# Altium project ESC_1S.PrjPcb
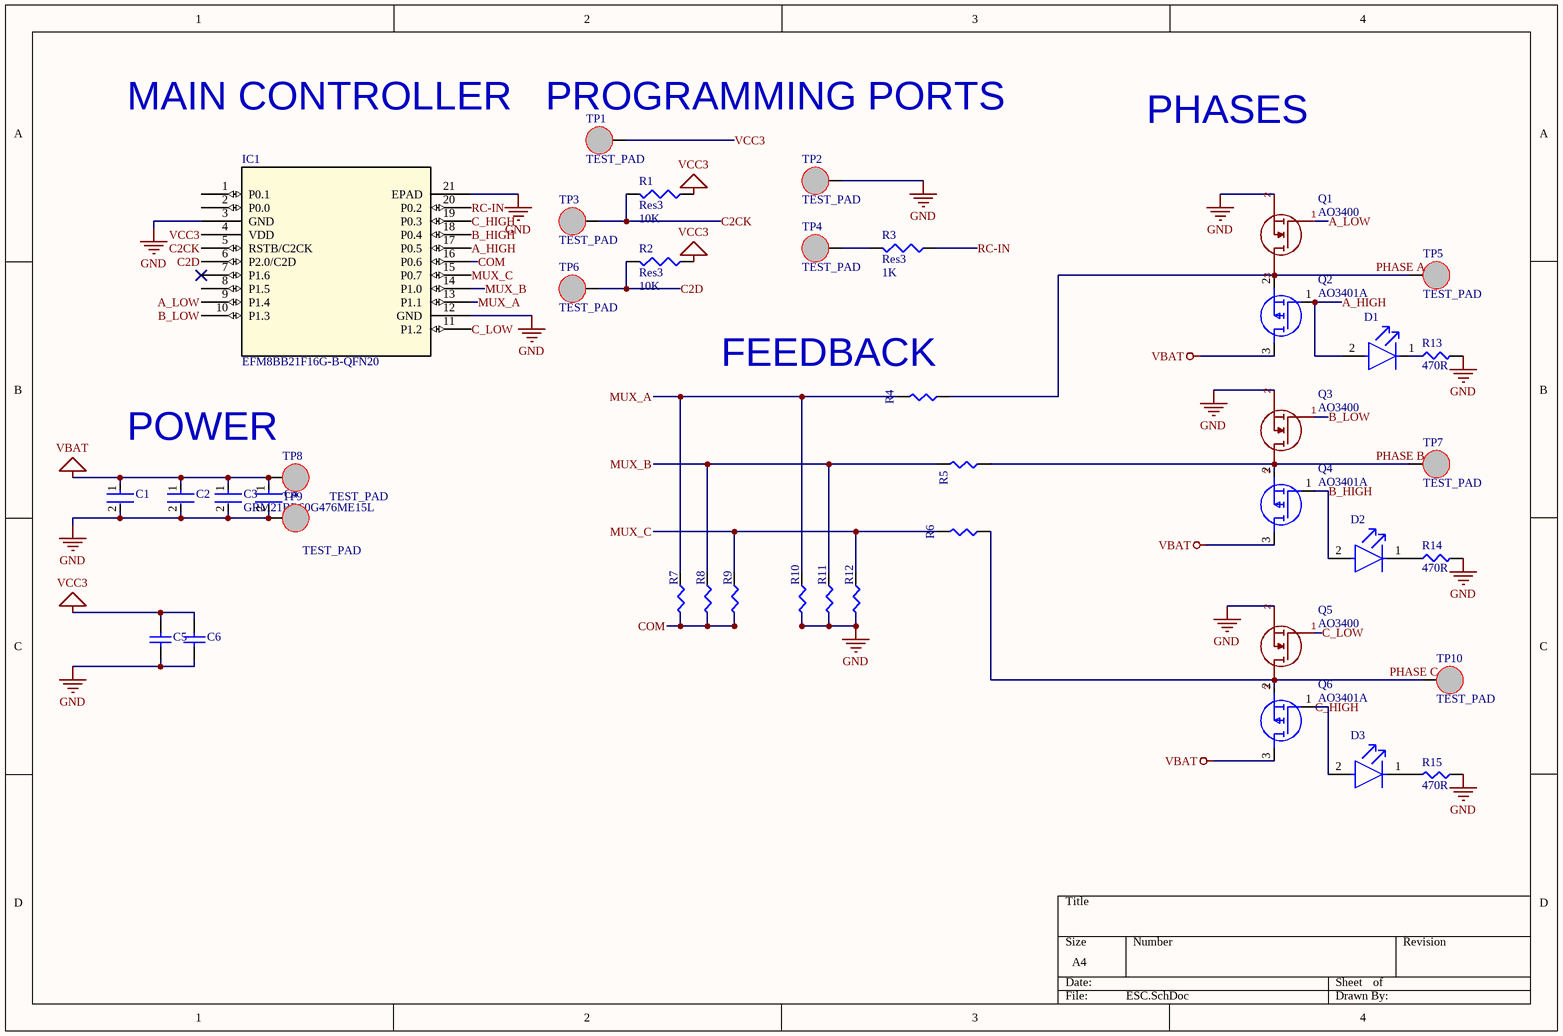
[diagram p0: ESC.SchDoc]
1 sheet, 41 parts. Net scope: global (net labels, ports and power ports of the same name join across sheets).
Board file: ESC.PcbDoc

## Sheet ESC.SchDoc
size A4; SheetNumber: 1; SheetTotal: 4

### Parts
C1  GRM21BR60G476ME15L  [FP-GRM21B-0_2-IPC_C]  (value not drawn)
C2  GRM21BR60G476ME15L  [FP-GRM21B-0_2-IPC_C]  (value not drawn)
C3  GRM21BR60G476ME15L  [FP-GRM21B-0_2-IPC_C]
C4  GRM21BR60G476ME15L  [FP-GRM21B-0_2-IPC_C]  (value not drawn)
C5  VJ0603Y104KNXAO  [CAPC1608X92X38LL15T08]  (value not drawn)
C6  VJ0603Y104KNXAO  [CAPC1608X92X38LL15T08]  (value not drawn)
D1  SML-LX0603IW-TR  [FP-SML-LX0603IW-TR-MFG]  (value not drawn)
D2  SML-LX0603IW-TR  [FP-SML-LX0603IW-TR-MFG]  (value not drawn)
D3  SML-LX0603IW-TR  [FP-SML-LX0603IW-TR-MFG]  (value not drawn)
IC1  EFM8BB21F16G-B-QFN20  [QFN20_3X3_SIL]
Q1  AO3400  [SOT-23-3L_AOS-L]
Q2  AO3401A  [SOT-23-3L_AOS-L]
Q3  AO3400  [SOT-23-3L_AOS-L]
Q4  AO3401A  [SOT-23-3L_AOS-L]
Q5  AO3400  [SOT-23-3L_AOS-L]
Q6  AO3401A  [SOT-23-3L_AOS-L]
R1  Res3  value 10K  [SMD-0603-RES]
R2  Res3  value 10K  [SMD-0603-RES]
R3  Res3  value 1K  [SMD-0603-RES]
R4  (no value)  [SMD-0603-RES]
R5  (no value)  [SMD-0603-RES]
R6  (no value)  [SMD-0603-RES]
R7  (no value)  [SMD-0603-RES]
R8  (no value)  [SMD-0603-RES]
R9  (no value)  [SMD-0603-RES]
R10  (no value)  [SMD-0603-RES]
R11  (no value)  [SMD-0603-RES]
R12  (no value)  [SMD-0603-RES]
R13  470R  [SMD-0603-RES]
R14  470R  [SMD-0603-RES]
R15  470R  [SMD-0603-RES]
TP1  TEST_PAD  [PCBComponent_1]
TP2  TEST_PAD  [PCBComponent_1]
TP3  TEST_PAD  [PCBComponent_1]
TP4  TEST_PAD  [PCBComponent_1]
TP5  TEST_PAD  [PAD_SQUARE]
TP6  TEST_PAD  [PCBComponent_1]
TP7  TEST_PAD  [PAD_SQUARE]
TP8  TEST_PAD  [PAD_SQUARE]
TP9  TEST_PAD  [PAD_SQUARE]
TP10  TEST_PAD  [PAD_SQUARE]

### Nets
GND: C1.2 C2.2 C3.2 C4.2 C5.1 C6.1 IC1.3(GND) IC1.12(GND) IC1.21(EPAD) Q1.2 Q3.2 Q5.2 R10.2 R11.2 R12.2 R13.2 R14.2 R15.1 TP2.1(Test_Point) TP9.1(Test_Point)
VBAT: C1.1 C2.1 C3.1 C4.1 Q2.3(D) Q4.3(D) Q6.3(D) TP8.1(Test_Point)
VCC3: C5.2 C6.2 IC1.4(VDD) R1.1 R2.1 TP1.1(Test_Point)
A_HIGH: D1.2(A) IC1.17(P0.5) Q2.1(G)
A_LOW: IC1.9(P1.4) Q1.1
B_HIGH: D2.2(A) IC1.18(P0.4) Q4.1(G)
B_LOW: IC1.10(P1.3) Q3.1
C2CK: IC1.5(RSTB/C2CK) R1.2 TP3.1(Test_Point)
C2D: IC1.6(P2.0/C2D) R2.2 TP6.1(Test_Point)
C_HIGH: D3.2(A) IC1.19(P0.3) Q6.1(G)
C_LOW: IC1.11(P1.2) Q5.1
COM: IC1.16(P0.6) R7.2 R8.2 R9.2
MUX_A: IC1.13(P1.1) R4.2 R7.1 R10.1
MUX_B: IC1.14(P1.0) R5.2 R8.1 R11.1
MUX_C: IC1.15(P0.7) R6.2 R9.1 R12.1
PHASE A: Q1.3 Q2.2(S) R4.1 TP5.1(Test_Point)
PHASE B: Q3.3 Q4.2(S) R5.1 TP7.1(Test_Point)
PHASE C: Q5.3 Q6.2(S) R6.1 TP10.1(Test_Point)
RC-IN: IC1.20(P0.2) R3.1
NetD1_1: D1.1(C) R13.1
NetD2_1: D2.1(C) R14.1
NetD3_1: D3.1(C) R15.2
NetR3_2: R3.2 TP4.1(Test_Point)

Not connected (* = marked no-connect by the designer): IC1 1(P0.1) 2(P0.0) 7(P1.6)* 8(P1.5)

### Notes on the sheet
- MAIN CONTROLLER
- (near TP1) PROGRAMMING PORTS
- PHASES
- (near R4) FEEDBACK
- POWER

### Library data of the parts
C1-C4 = CMP-2007-03226-2: CAP CER 47UF 4V X5R 0805; Tolerance: 20%; Termination: SMD/SMT; Min Operating Temperature: -55°C; Max Operating Temperature: 85°C; REACH SVHC: No SVHC; Length: 2mm; Height: 1.25mm; Thickness: 0.053inch; Mount: Surface Mount; RoHS Compliant: Yes; Voltage Rating: 4V; Package Quantity: 3000; Width: 0.049inch; Capacitance: 47uF; Case Code (Metric): 2012; Series: GRM; Radiation Hardening: No; Case/Package: 0805; Voltage: 4V; Construction: Flat; Packaging: Tape and Reel; Lead Free: Lead Free; Depth: 1.25mm; Case Code (Imperial): 0805; Dielectric: X5R; Voltage Rating (DC): 4V
C5 C6 = CMP-1035-02588-2: Manufacturer: Vitramon; Part Number: VJ0603Y104KNXAO
D1-D3 = CMP-57192-000012-1: LED RED DIFFUSED SMD; Luminous Intensity: 14mcd; Test Current: 20mA; Viewing Angle: 160°; Approvals: UL; Forward Voltage: 2V; Power Dissipation: 50mW; Dominant Wavelength: 635nm; Number of LEDs: 1; Lens Color: White; Height: 0.6mm; RoHS Compliant: Yes; Lead Free: Lead Free; Number of Pins: 2; Packaging: Tape and Reel; Case/Package: 0603; Length: 1.6mm; Color: Red; Max Operating Temperature: 85°C; Illumination Color: Red; Case Code (Metric): 1608; Diameter: 0.061inch; Min Operating Temperature: -25°C; Lens Style: Diffused; Mount: Surface Mount; Width: 0.8mm; Case Code (Imperial): 0603; Lens Transparency: Diffused; Wavelength: 635nm; Package Quantity: 1; Forward Current: 20mA
IC1 = EFM8BB21F16G-B-QFN20: No Description Available; Mfr_Name: Silicon Labs; Copyright: Copyright (C) 2023 Ultra Librarian. All rights reserved.; Manufacturer_Part_Number: EFM8BB21F16G-B-QFN20; RefDes: RefDes; Type: DEV
Q2 Q4 Q6 = AO3401A: MOSFET (P-Channel); Manufacturer_Name: Alpha & Omega Semiconductors; Datasheet Link: http://www.aosmd.com/pdfs/datasheet/AO3401A.pdf; Height: 1.25mm; Manufacturer_Part_Number: AO3401A; Arrow Part Number: AO3401A; Arrow Price/Stock: https://www.arrow.com/en/products/ao3401a/alpha-and-omega-semiconductor?region=nac
R1-R3 = Res3: Resistor; Published: 8-Jun-2000; LatestRevisionDate: 29-May-2009; LatestRevisionNote: IPC-7351 Footprint Added.; PackageReference: J1-0603; Publisher: Altium Limited; PackageDescription: Chip Resistor
R4-R15 = RESISTOR
  R13: Value: 470R; Parameter 1: *
  R14 R15: Value: 470R